# Altium schematic sheet E2.SchDoc
size 420 x 297 mm; DocumentNumber: ИУ4.11.03.03.25.06.62.14.001 Э2; SheetNumber: 2; SheetTotal: 3; DocumentType: Схема электрическая функциональная
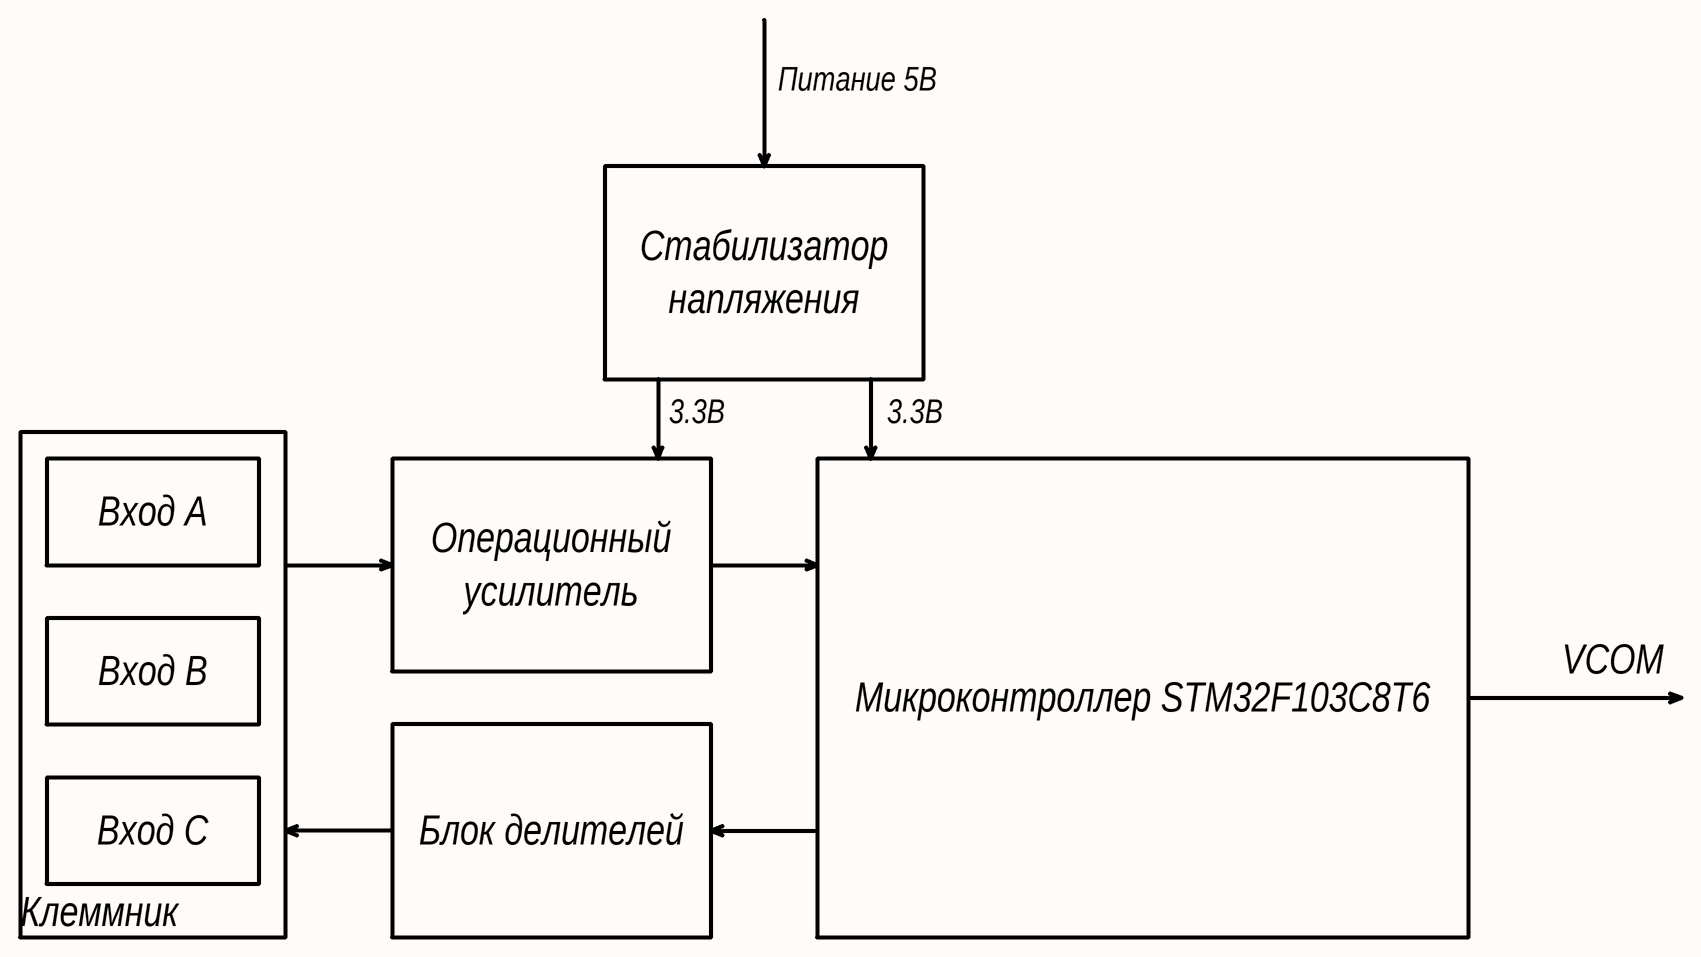
[diagram p0: E2.SchDoc]

## Notes on the sheet
- Питание 5В
- Стабилизатор
- напляжения
- 3.3В
- Вход A
- Операционный
- усилитель
- Вход B
- Микроконтроллер STM32F103C8T6
- VCOM
- Вход C
- Блок делителей
- Клеммник
- Перв. примен.
- Справ. №
- Подп. и дата
- Инв. № дубл.
- Взам. инв. №
- Разраб.
- Изм.
- Лист
- № докум.
- Подп.
- Дата
- Лит.
- Масса
- Масштаб
- Пров.
- Т.контр.
- Листов
- 1
- Инв. № подл.
- Утв.
- Н.контр.
- Кафедра ИУ4
- МГТУ им. Н. Э. Баумана
- 2.106-A3
- Копировал
- Формат А3
- Группа ИУ4-62Б